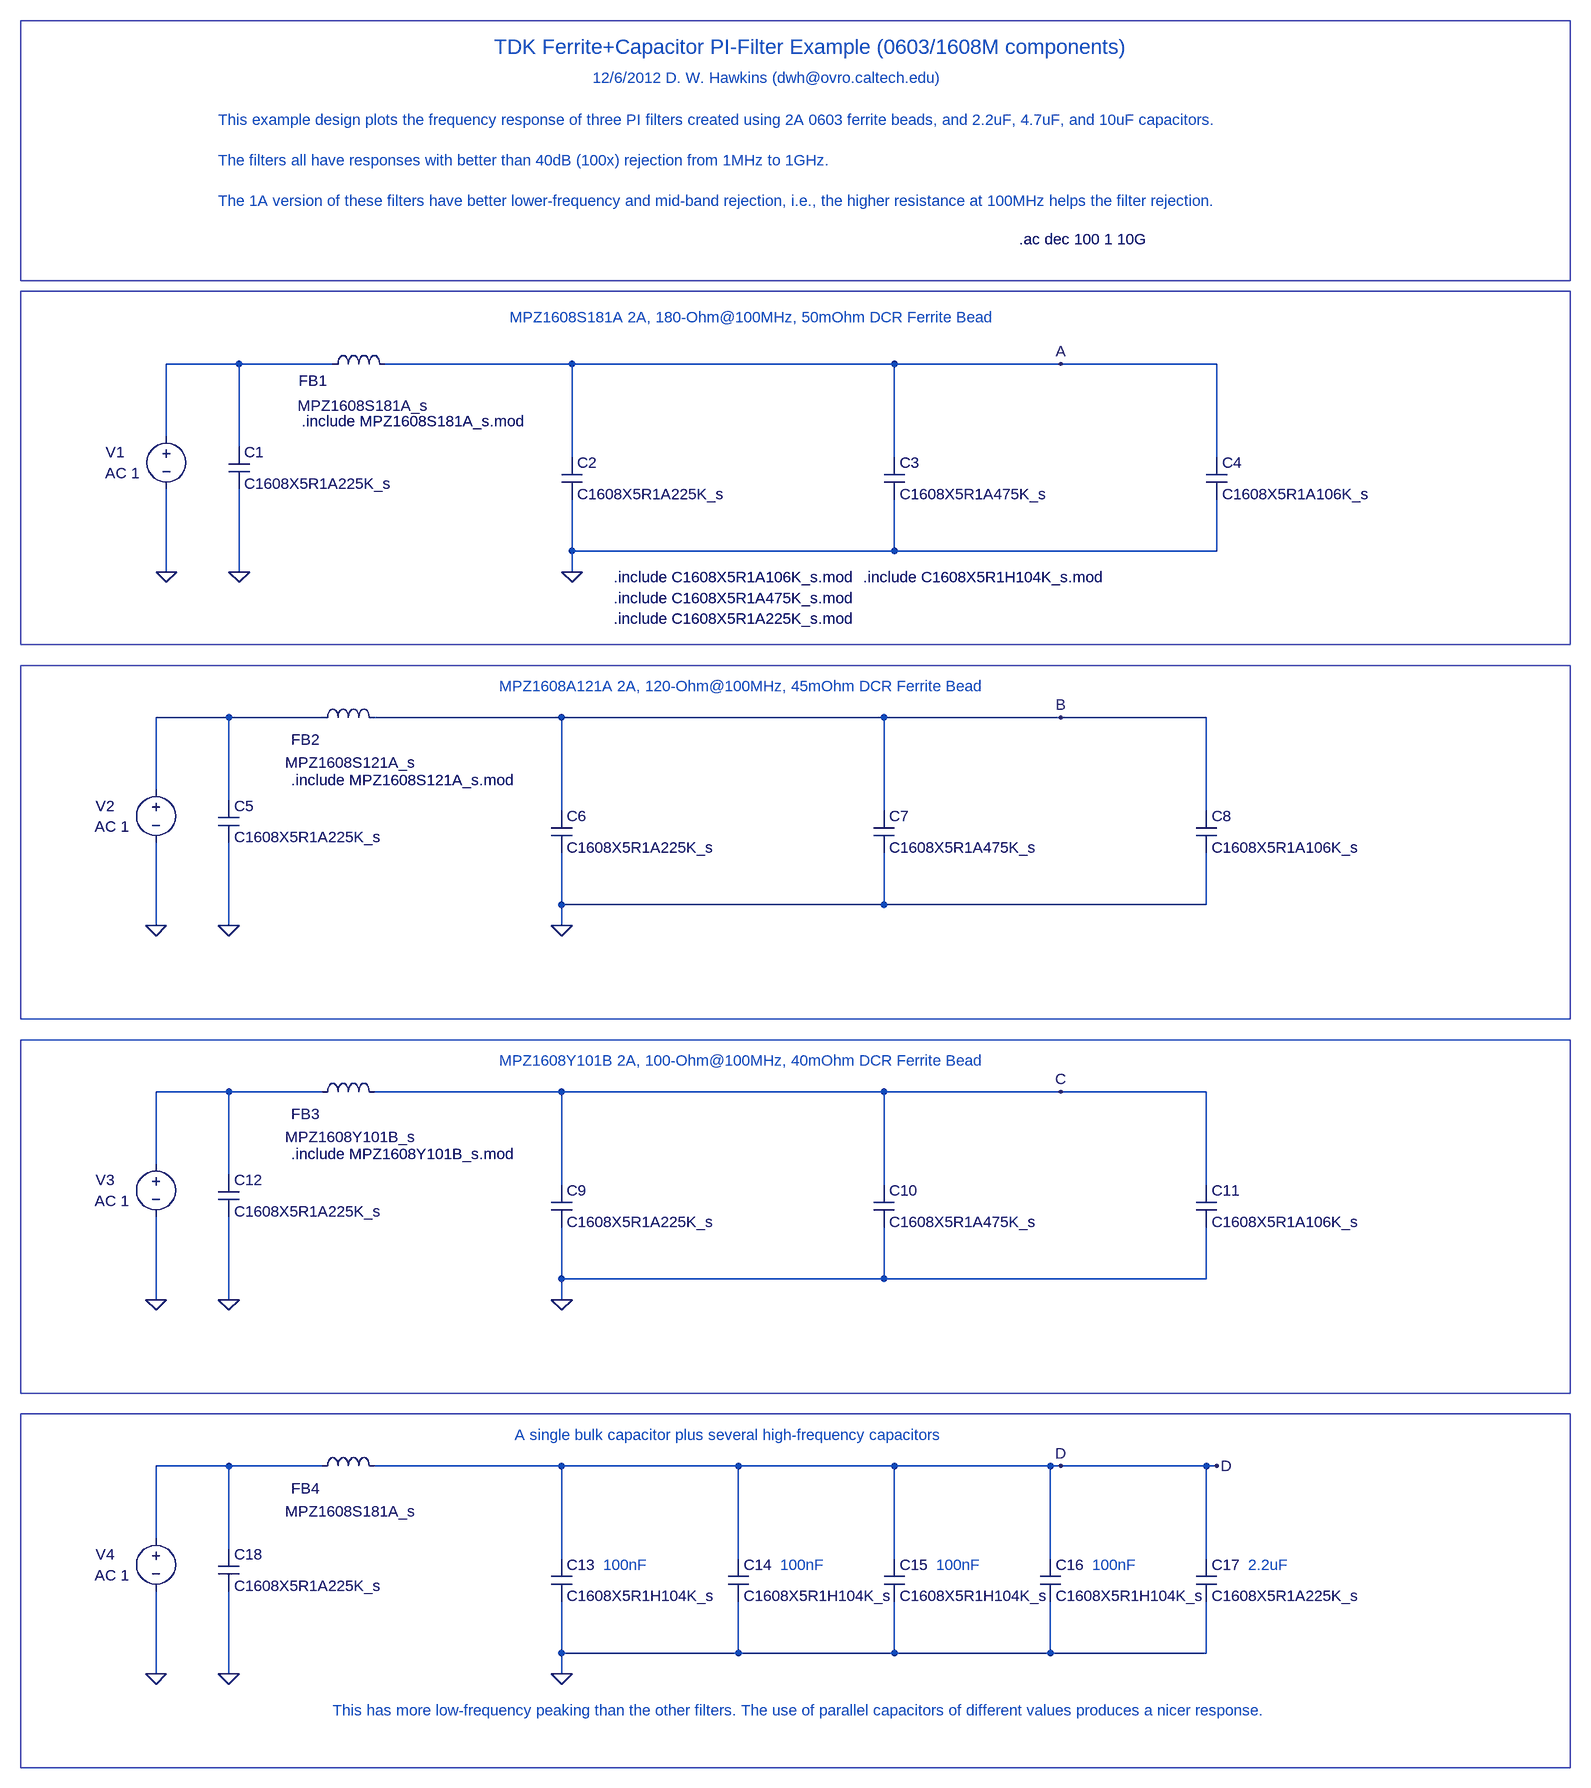
[diagram p0: schematic pi_filter_0603_2A.asc]
pi_filter_0603_2A.asc, the LTspice schematic file:
Version 4
SHEET 1 2444 2116
WIRE 304 -48 192 -48
WIRE 448 -48 304 -48
WIRE 816 -48 528 -48
WIRE 1312 -48 816 -48
WIRE 1568 -48 1312 -48
WIRE 1808 -48 1568 -48
WIRE 192 64 192 -48
WIRE 304 80 304 -48
WIRE 816 96 816 -48
WIRE 1312 96 1312 -48
WIRE 1808 96 1808 -48
WIRE 816 240 816 160
WIRE 1312 240 1312 160
WIRE 1312 240 816 240
WIRE 1808 240 1808 160
WIRE 1808 240 1312 240
WIRE 192 272 192 144
WIRE 304 272 304 144
WIRE 816 272 816 240
WIRE 288 496 176 496
WIRE 432 496 288 496
WIRE 800 496 512 496
WIRE 1296 496 800 496
WIRE 1568 496 1296 496
WIRE 1792 496 1568 496
WIRE 176 608 176 496
WIRE 288 624 288 496
WIRE 800 640 800 496
WIRE 1296 640 1296 496
WIRE 1792 640 1792 496
WIRE 800 784 800 704
WIRE 1296 784 1296 704
WIRE 1296 784 800 784
WIRE 1792 784 1792 704
WIRE 1792 784 1296 784
WIRE 176 816 176 688
WIRE 288 816 288 688
WIRE 800 816 800 784
WIRE 288 1072 176 1072
WIRE 432 1072 288 1072
WIRE 800 1072 512 1072
WIRE 1296 1072 800 1072
WIRE 1568 1072 1296 1072
WIRE 1792 1072 1568 1072
WIRE 176 1184 176 1072
WIRE 288 1200 288 1072
WIRE 800 1216 800 1072
WIRE 1296 1216 1296 1072
WIRE 1792 1216 1792 1072
WIRE 800 1360 800 1280
WIRE 1296 1360 1296 1280
WIRE 1296 1360 800 1360
WIRE 1792 1360 1792 1280
WIRE 1792 1360 1296 1360
WIRE 176 1392 176 1264
WIRE 288 1392 288 1264
WIRE 800 1392 800 1360
WIRE 288 1648 176 1648
WIRE 432 1648 288 1648
WIRE 800 1648 512 1648
WIRE 1072 1648 800 1648
WIRE 1312 1648 1072 1648
WIRE 1552 1648 1312 1648
WIRE 1568 1648 1552 1648
WIRE 1792 1648 1568 1648
WIRE 1808 1648 1792 1648
WIRE 176 1760 176 1648
WIRE 288 1776 288 1648
WIRE 800 1792 800 1648
WIRE 1072 1792 1072 1648
WIRE 1312 1792 1312 1648
WIRE 1552 1792 1552 1648
WIRE 1792 1792 1792 1648
WIRE 800 1936 800 1856
WIRE 1072 1936 1072 1856
WIRE 1072 1936 800 1936
WIRE 1312 1936 1312 1856
WIRE 1312 1936 1072 1936
WIRE 1552 1936 1552 1856
WIRE 1552 1936 1312 1936
WIRE 1792 1936 1792 1856
WIRE 1792 1936 1552 1936
WIRE 176 1968 176 1840
WIRE 288 1968 288 1840
WIRE 800 1968 800 1936
FLAG 192 272 0
FLAG 304 272 0
FLAG 816 272 0
FLAG 176 816 0
FLAG 288 816 0
FLAG 800 816 0
FLAG 1568 -48 A
FLAG 1568 496 B
FLAG 176 1392 0
FLAG 288 1392 0
FLAG 800 1392 0
FLAG 1568 1072 C
FLAG 176 1968 0
FLAG 288 1968 0
FLAG 800 1968 0
FLAG 1568 1648 D
FLAG 1808 1648 D
SYMBOL ind 432 -32 R270
WINDOW 0 -25 -14 VTop 2
WINDOW 3 -33 63 VBottom 2
SYMATTR InstName FB1
SYMATTR Value MPZ1608S181A_s
SYMATTR Prefix X
SYMBOL cap 800 96 R0
SYMATTR InstName C2
SYMATTR Value C1608X5R1A225K_s
SYMATTR Prefix X
SYMBOL cap 1296 96 R0
SYMATTR InstName C3
SYMATTR Value C1608X5R1A475K_s
SYMATTR Prefix X
SYMBOL cap 1792 96 R0
SYMATTR InstName C4
SYMATTR Value C1608X5R1A106K_s
SYMATTR Prefix X
SYMBOL cap 288 80 R0
SYMATTR InstName C1
SYMATTR Value C1608X5R1A225K_s
SYMATTR Prefix X
SYMBOL voltage 192 48 R0
WINDOW 0 -93 40 Left 2
WINDOW 123 -94 72 Left 2
WINDOW 39 0 0 Left 2
SYMATTR InstName V1
SYMATTR Value2 AC 1
SYMATTR Value ""
SYMBOL ind 416 512 R270
WINDOW 0 -34 -10 VTop 2
WINDOW 3 -38 60 VBottom 2
SYMATTR InstName FB2
SYMATTR Value MPZ1608S121A_s
SYMATTR Prefix X
SYMBOL cap 784 640 R0
SYMATTR InstName C6
SYMATTR Value C1608X5R1A225K_s
SYMATTR Prefix X
SYMBOL cap 1280 640 R0
SYMATTR InstName C7
SYMATTR Value C1608X5R1A475K_s
SYMATTR Prefix X
SYMBOL cap 1776 640 R0
SYMATTR InstName C8
SYMATTR Value C1608X5R1A106K_s
SYMATTR Prefix X
SYMBOL cap 272 624 R0
SYMATTR InstName C5
SYMATTR Value C1608X5R1A225K_s
SYMATTR Prefix X
SYMBOL voltage 176 592 R0
WINDOW 0 -93 40 Left 2
WINDOW 123 -94 72 Left 2
WINDOW 39 0 0 Left 2
SYMATTR InstName V2
SYMATTR Value2 AC 1
SYMATTR Value ""
SYMBOL ind 416 1088 R270
WINDOW 0 -34 -10 VTop 2
WINDOW 3 -38 60 VBottom 2
SYMATTR InstName FB3
SYMATTR Value MPZ1608Y101B_s
SYMATTR Prefix X
SYMBOL cap 784 1216 R0
SYMATTR InstName C9
SYMATTR Value C1608X5R1A225K_s
SYMATTR Prefix X
SYMBOL cap 1280 1216 R0
SYMATTR InstName C10
SYMATTR Value C1608X5R1A475K_s
SYMATTR Prefix X
SYMBOL cap 1776 1216 R0
SYMATTR InstName C11
SYMATTR Value C1608X5R1A106K_s
SYMATTR Prefix X
SYMBOL cap 272 1200 R0
SYMATTR InstName C12
SYMATTR Value C1608X5R1A225K_s
SYMATTR Prefix X
SYMBOL voltage 176 1168 R0
WINDOW 0 -93 40 Left 2
WINDOW 123 -94 72 Left 2
WINDOW 39 0 0 Left 2
SYMATTR InstName V3
SYMATTR Value2 AC 1
SYMATTR Value ""
SYMBOL ind 416 1664 R270
WINDOW 0 -34 -10 VTop 2
WINDOW 3 -38 60 VBottom 2
SYMATTR InstName FB4
SYMATTR Value MPZ1608S181A_s
SYMATTR Prefix X
SYMBOL cap 784 1792 R0
SYMATTR InstName C13
SYMATTR Value C1608X5R1H104K_s
SYMATTR Prefix X
SYMBOL cap 1056 1792 R0
SYMATTR InstName C14
SYMATTR Value C1608X5R1H104K_s
SYMATTR Prefix X
SYMBOL cap 1776 1792 R0
SYMATTR InstName C17
SYMATTR Value C1608X5R1A225K_s
SYMATTR Prefix X
SYMBOL cap 272 1776 R0
SYMATTR InstName C18
SYMATTR Value C1608X5R1A225K_s
SYMATTR Prefix X
SYMBOL voltage 176 1744 R0
WINDOW 0 -93 40 Left 2
WINDOW 123 -94 72 Left 2
WINDOW 39 0 0 Left 2
SYMATTR InstName V4
SYMATTR Value2 AC 1
SYMATTR Value ""
SYMBOL cap 1296 1792 R0
SYMATTR InstName C15
SYMATTR Value C1608X5R1H104K_s
SYMATTR Prefix X
SYMBOL cap 1536 1792 R0
SYMATTR InstName C16
SYMATTR Value C1608X5R1H104K_s
SYMATTR Prefix X
TEXT 1504 -240 Left 2 !.ac dec 100 1 10G
TEXT 400 40 Left 2 !.include MPZ1608S181A_s.mod
TEXT 720 -120 Left 2 ;MPZ1608S181A 2A, 180-Ohm@100MHz, 50mOhm DCR Ferrite Bead
TEXT 704 448 Left 2 ;MPZ1608A121A 2A, 120-Ohm@100MHz, 45mOhm DCR Ferrite Bead
TEXT 696 -536 Left 3 ;TDK Ferrite+Capacitor PI-Filter Example (0603/1608M components)
TEXT 848 -488 Left 2 ;12/6/2012 D. W. Hawkins (dwh@ovro.caltech.edu)
TEXT 272 -424 Left 2 ;This example design plots the frequency response of three PI filters created using 2A 0603 ferrite beads, and 2.2uF, 4.7uF, and 10uF capacitors.\n \nThe filters all have responses with better than 40dB (100x) rejection from 1MHz to 1GHz.\n \nThe 1A version of these filters have better lower-frequency and mid-band rejection, i.e., the higher resistance at 100MHz helps the filter rejection.
TEXT 880 312 Left 2 !.include C1608X5R1A475K_s.mod
TEXT 880 344 Left 2 !.include C1608X5R1A225K_s.mod
TEXT 880 280 Left 2 !.include C1608X5R1A106K_s.mod
TEXT 384 592 Left 2 !.include MPZ1608S121A_s.mod
TEXT 704 1024 Left 2 ;MPZ1608Y101B 2A, 100-Ohm@100MHz, 40mOhm DCR Ferrite Bead
TEXT 384 1168 Left 2 !.include MPZ1608Y101B_s.mod
TEXT 1264 280 Left 2 !.include C1608X5R1H104K_s.mod
TEXT 864 1800 Left 2 ;100nF
TEXT 1136 1800 Left 2 ;100nF
TEXT 1856 1800 Left 2 ;2.2uF
TEXT 728 1600 Left 2 ;A single bulk capacitor plus several high-frequency capacitors
TEXT 1376 1800 Left 2 ;100nF
TEXT 1616 1800 Left 2 ;100nF
TEXT 448 2024 Left 2 ;This has more low-frequency peaking than the other filters. The use of parallel capacitors of different values produces a nicer response.
RECTANGLE Normal 2352 384 -32 -160
RECTANGLE Normal 2352 -176 -32 -576
RECTANGLE Normal 2352 960 -32 416
RECTANGLE Normal 2352 1536 -32 992
RECTANGLE Normal 2352 2112 -32 1568

The netlist it stands for:
* pi_filter_0603_2A.asc
XFB1 N001 A MPZ1608S181A_s  ; pins A B
XC2 A 0 C1608X5R1A225K_s  ; pins A B
XC3 A 0 C1608X5R1A475K_s  ; pins A B
XC4 A 0 C1608X5R1A106K_s  ; pins A B
XC1 N001 0 C1608X5R1A225K_s  ; pins A B
V1 N001 0 AC 1
XFB2 N002 B MPZ1608S121A_s  ; pins A B
XC6 B 0 C1608X5R1A225K_s  ; pins A B
XC7 B 0 C1608X5R1A475K_s  ; pins A B
XC8 B 0 C1608X5R1A106K_s  ; pins A B
XC5 N002 0 C1608X5R1A225K_s  ; pins A B
V2 N002 0 AC 1
XFB3 N003 C MPZ1608Y101B_s  ; pins A B
XC9 C 0 C1608X5R1A225K_s  ; pins A B
XC10 C 0 C1608X5R1A475K_s  ; pins A B
XC11 C 0 C1608X5R1A106K_s  ; pins A B
XC12 N003 0 C1608X5R1A225K_s  ; pins A B
V3 N003 0 AC 1
XFB4 N004 D MPZ1608S181A_s  ; pins A B
XC13 D 0 C1608X5R1H104K_s  ; pins A B
XC14 D 0 C1608X5R1H104K_s  ; pins A B
XC17 D 0 C1608X5R1A225K_s  ; pins A B
XC18 N004 0 C1608X5R1A225K_s  ; pins A B
V4 N004 0 AC 1
XC15 D 0 C1608X5R1H104K_s  ; pins A B
XC16 D 0 C1608X5R1H104K_s  ; pins A B
.ac dec 100 1 10G
.include MPZ1608S181A_s.mod
* MPZ1608S181A 2A, 180-Ohm@100MHz, 50mOhm DCR Ferrite Bead
* MPZ1608A121A 2A, 120-Ohm@100MHz, 45mOhm DCR Ferrite Bead
* TDK Ferrite+Capacitor PI-Filter Example (0603/1608M components)
* 12/6/2012 D. W. Hawkins (dwh@ovro.caltech.edu)
* This example design plots the frequency response of three PI filters created using 2A 0603 ferrite beads, and 2.2uF, 4.7uF, and 10uF capacitors.
* The filters all have responses with better than 40dB (100x) rejection from 1MHz to 1GHz.
* The 1A version of these filters have better lower-frequency and mid-band rejection, i.e., the higher resistance at 100MHz helps the filter rejection.
.include C1608X5R1A475K_s.mod
.include C1608X5R1A225K_s.mod
.include C1608X5R1A106K_s.mod
.include MPZ1608S121A_s.mod
* MPZ1608Y101B 2A, 100-Ohm@100MHz, 40mOhm DCR Ferrite Bead
.include MPZ1608Y101B_s.mod
.include C1608X5R1H104K_s.mod
* 100nF
* 100nF
* 2.2uF
* A single bulk capacitor plus several high-frequency capacitors
* 100nF
* 100nF
* This has more low-frequency peaking than the other filters. The use of parallel capacitors of different values produces a nicer response.
.backanno
.end